# EAGLE design 4 x MIDI Thru Box with LED (EAGLE 6.5.0)
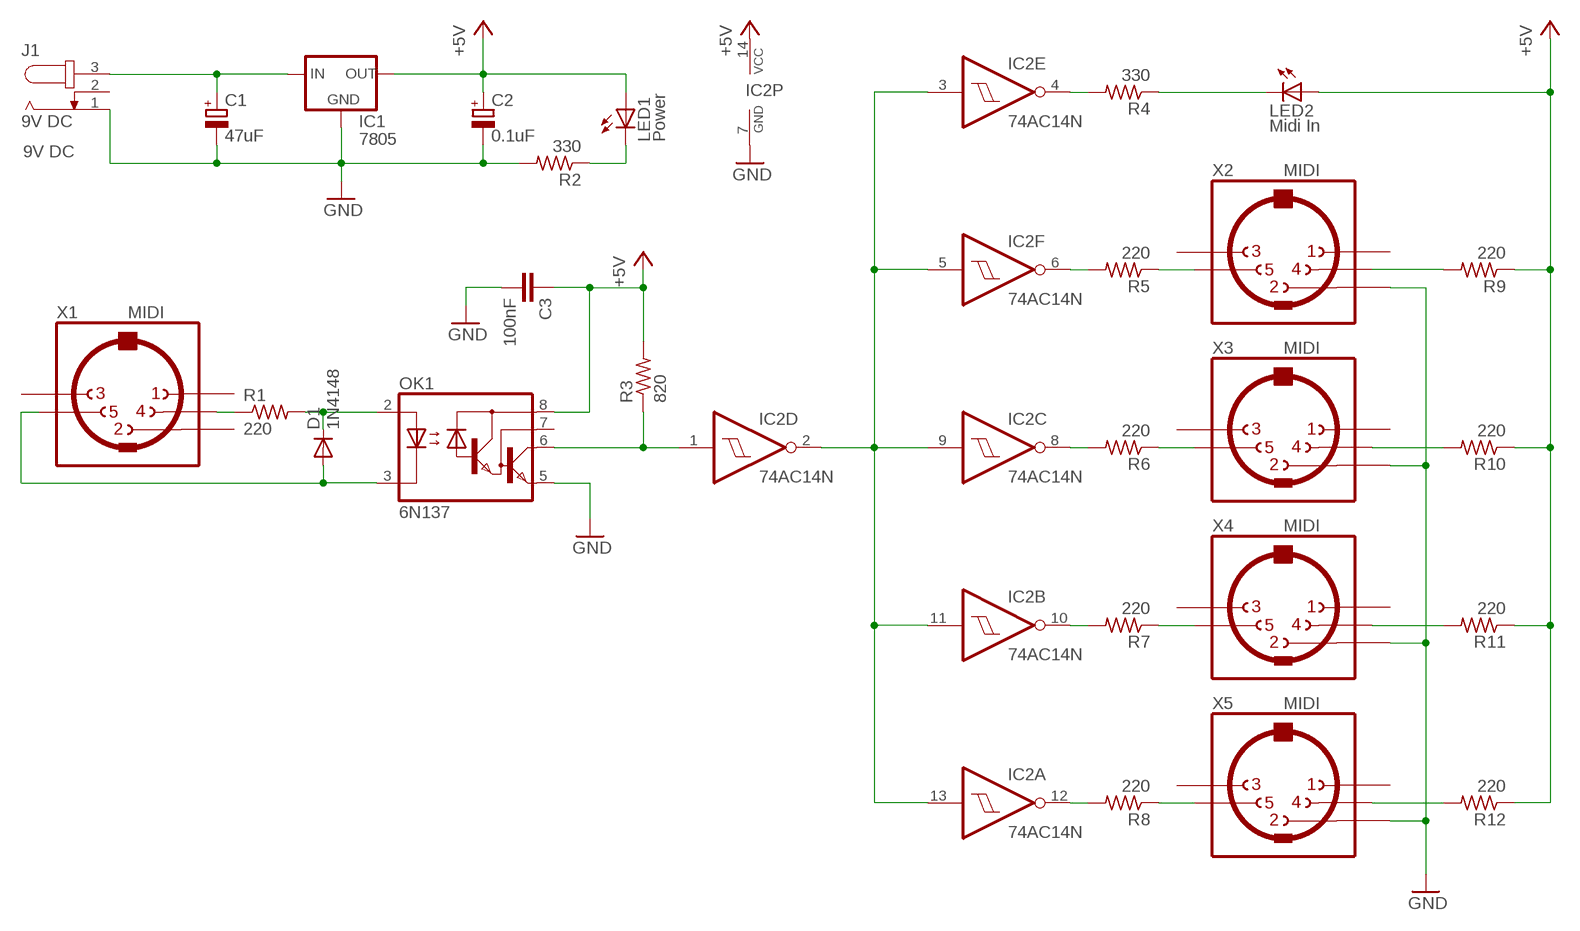
[diagram p0: schematic, sheet 1]

## Parts
C1  47uF  CPOL-EUTT2D6  [TT2D6]
C2  0.1uF  CPOL-EUTT2D6  [TT2D6]
C3  100nF  C-EU025-024X044  [C025-024X044]
D1  1N4148  DIODE-D-5  [D-5]
IC1  7805  78XXS  [78XXS]
IC2  74AC14N  [DIL14]
J1  9V DC  JACK-PLUG2  [SPC4078_BIG_HOLES]
LED1  Power  LED3MM  [LED3MM]
LED2  Midi In  LED3MM  [LED3MM]
OK1  6N137  6N138  [DIL08]
R1  220  R-US_0204/7  [0204/7]
R2  330  R-US_0204/7  [0204/7]
R3  820  R-US_0204/7  [0204/7]
R4  330  R-US_0204/7  [0204/7]
R5  220  R-US_0204/7  [0204/7]
R6  220  R-US_0204/7  [0204/7]
R7  220  R-US_0204/7  [0204/7]
R8  220  R-US_0204/7  [0204/7]
R9  220  R-US_0204/7  [0204/7]
R10  220  R-US_0204/7  [0204/7]
R11  220  R-US_0204/7  [0204/7]
R12  220  R-US_0204/7  [0204/7]
X1  MIDI  MAB5SH  [MAB5SH]
X2  MIDI  MAB5SH  [MAB5SH]
X3  MIDI  MAB5SH  [MAB5SH]
X4  MIDI  MAB5SH  [MAB5SH]
X5  MIDI  MAB5SH  [MAB5SH]

## Nets
+5V: C2.+ C3.1 IC1.OUT IC2.14(P:VCC) LED1.A LED2.A OK1.8(VCC) R3.2 R9.1 R10.1 R11.1 R12.1
GND: C1.- C2.- C3.2 IC1.GND IC2.7(P:GND) J1.1 OK1.5(GND) R2.2 X2.2 X3.2 X4.2 X5.2
MIDI_IN: IC2.1(D:I) OK1.6(VO) R3.1
N$1: IC2.6(F:O) R5.2
N$2: IC2.10(B:O) R7.2
N$3: R8.1 X5.5
N$4: R9.2 X2.4
N$5: LED2.K(C) R4.1
N$6: C1.+ IC1.IN J1.3
N$7: R1.1 X1.4
N$9: LED1.K(C) R2.1
N$11: D1.A OK1.3(C) X1.5
N$14: D1.C OK1.2(A) R1.2
N$17: IC2.2(D:O) IC2.3(E:I) IC2.5(F:I) IC2.9(C:I) IC2.11(B:I) IC2.13(A:I)
N$21: R7.1 X4.5
N$22: IC2.8(C:O) R6.2
N$23: R5.1 X2.5
N$26: IC2.12(A:O) R8.2
N$41: R6.1 X3.5
N$52: R12.2 X5.4
N$53: R11.2 X4.4
N$54: R10.2 X3.4
N$65: IC2.4(E:O) R4.2
Unconnected: J1.2 OK1.7(VB) X1.1 X1.2 X1.3 X2.1 X2.3 X3.1 X3.3 X4.1 X4.3 X5.1 X5.3

## Notes on the sheet
- 9V DC

## Library data of the parts
C1 C2 = rcl:CPOL-EU: POLARIZED CAPACITOR, European symbol
C3 = rcl:C-EU: CAPACITOR, European symbol
D1 = diode:DIODE-: DIODE
IC1 = v-reg:78XXS: VOLTAGE REGULATOR
IC2 = 74xx-eu:74*14: Hex schmitt trigger INVERTER
J1 = con-jack2:JACK-PLUG: DC POWER JACK Power Jack, DC, Right Angle, Through Hole, Rated 5A at 16VDC, PC Terminals Distributor: Farnell (www.Farnell.de) Drawing: 84N1161.pdf / 84N1162.pdf Manufacturer: SPC Technology (www.spctechnology.com) Type: SPC4077 / SPC 4078
LED1 LED2 = led:LED: LED OSRAM: - CHIPLED LG R971, LG N971, LY N971, LG Q971, LY Q971, LO R971, LY R971 LH N974, LH R974 LS Q976, LO Q976, LY Q976 LO Q996 - Hyper CHIPLED LW Q18S LB Q993, LB Q99A, LB R99A - SideLED LS A670, LO A670, LY A670, LG A670, LP A670 LB A673, LV A673, LT A673, LW A673 LH A674 LY A675 LS A676, LA A676, LO A676, LY A676, LW A676 LS A679, LY A679, LG A679 - Hyper Micro SIDELED® LS Y876, LA Y876, LO Y876, LY Y876 LT Y87S - SmartLED LW L88C, LW L88S LB L89C, LB L89S, LG L890 LS L89K, LO L89K, LY L89K LS L896, LA L896, LO L896, LY L896 - TOPLED LS T670, LO T670, LY T670, LG T670, LP T670 LSG T670, LSP T670, LSY T670, LOP T670, LYG T670 LG T671, LOG T671, LSG T671 LB T673, LV T673, LT T673, LW T673 LH T674 LS T676, LA T676, LO T676, LY T676, LB T676, LH T676, LSB T676, LW T676 LB T67C, LV T67C, LT T67C, LS T67K, LO T67K, LY T67K, LW E67C LS E67B, LA E67B, LO E67B, LY E67B, LB E67C, LV E67C, LT E67C LW T67C LS T679, LY T679, LG T679 LS T770, LO T770, LY T770, LG T770, LP T770 LB T773, LV T773, LT T773, LW T773 LH T774 LS E675, LA E675, LY E675, LS T675 LS T776, LA T776, LO T776, LY T776, LB T776 LHGB T686 LT T68C, LB T68C - Hyper Mini TOPLED® LB M676 - Mini TOPLED Santana® LG M470 LS M47K, LO M47K, LY M47K Source: http://www.osram.convergy.de LUXEON: - LUMILED® LXK2-PW12-R00, LXK2-PW12-S00, LXK2-PW14-U00, LXK2-PW14-V00 LXK2-PM12-R00, LXK2-PM12-S00, LXK2-PM14-U00 LXK2-PE12-Q00, LXK2-PE12-R00, LXK2-PE12-S00, LXK2-PE14-T00, LXK2-PE14-U00 LXK2-PB12-K00, LXK2-PB12-L00, LXK2-PB12-M00, LXK2-PB14-N00, LXK2-PB14-P00, LXK2-PB14-Q00 LXK2-PR12-L00, LXK2-PR12-M00, LXK2-PR14-Q00, LXK2-PR14-R00 LXK2-PD12-Q00, LXK2-PD12-R00, LXK2-PD12-S00 LXK2-PH12-R00, LXK2-PH12-S00 LXK2-PL12-P00, LXK2-PL12-Q00, LXK2-PL12-R00 Source: www.luxeon.com KINGBRIGHT: KA-3528ASYC Source: www.kingbright.com
OK1 = optocoupler:6N138: MOTOROLA OPTO COUPLER
R1-R12 = rcl:R-US_: RESISTOR, American symbol
X1-X5 = og-midi:MAB5SH: Female CONNECTOR 5 pins 90 deg. with shield, horizontal (DIN 41524)

## Board
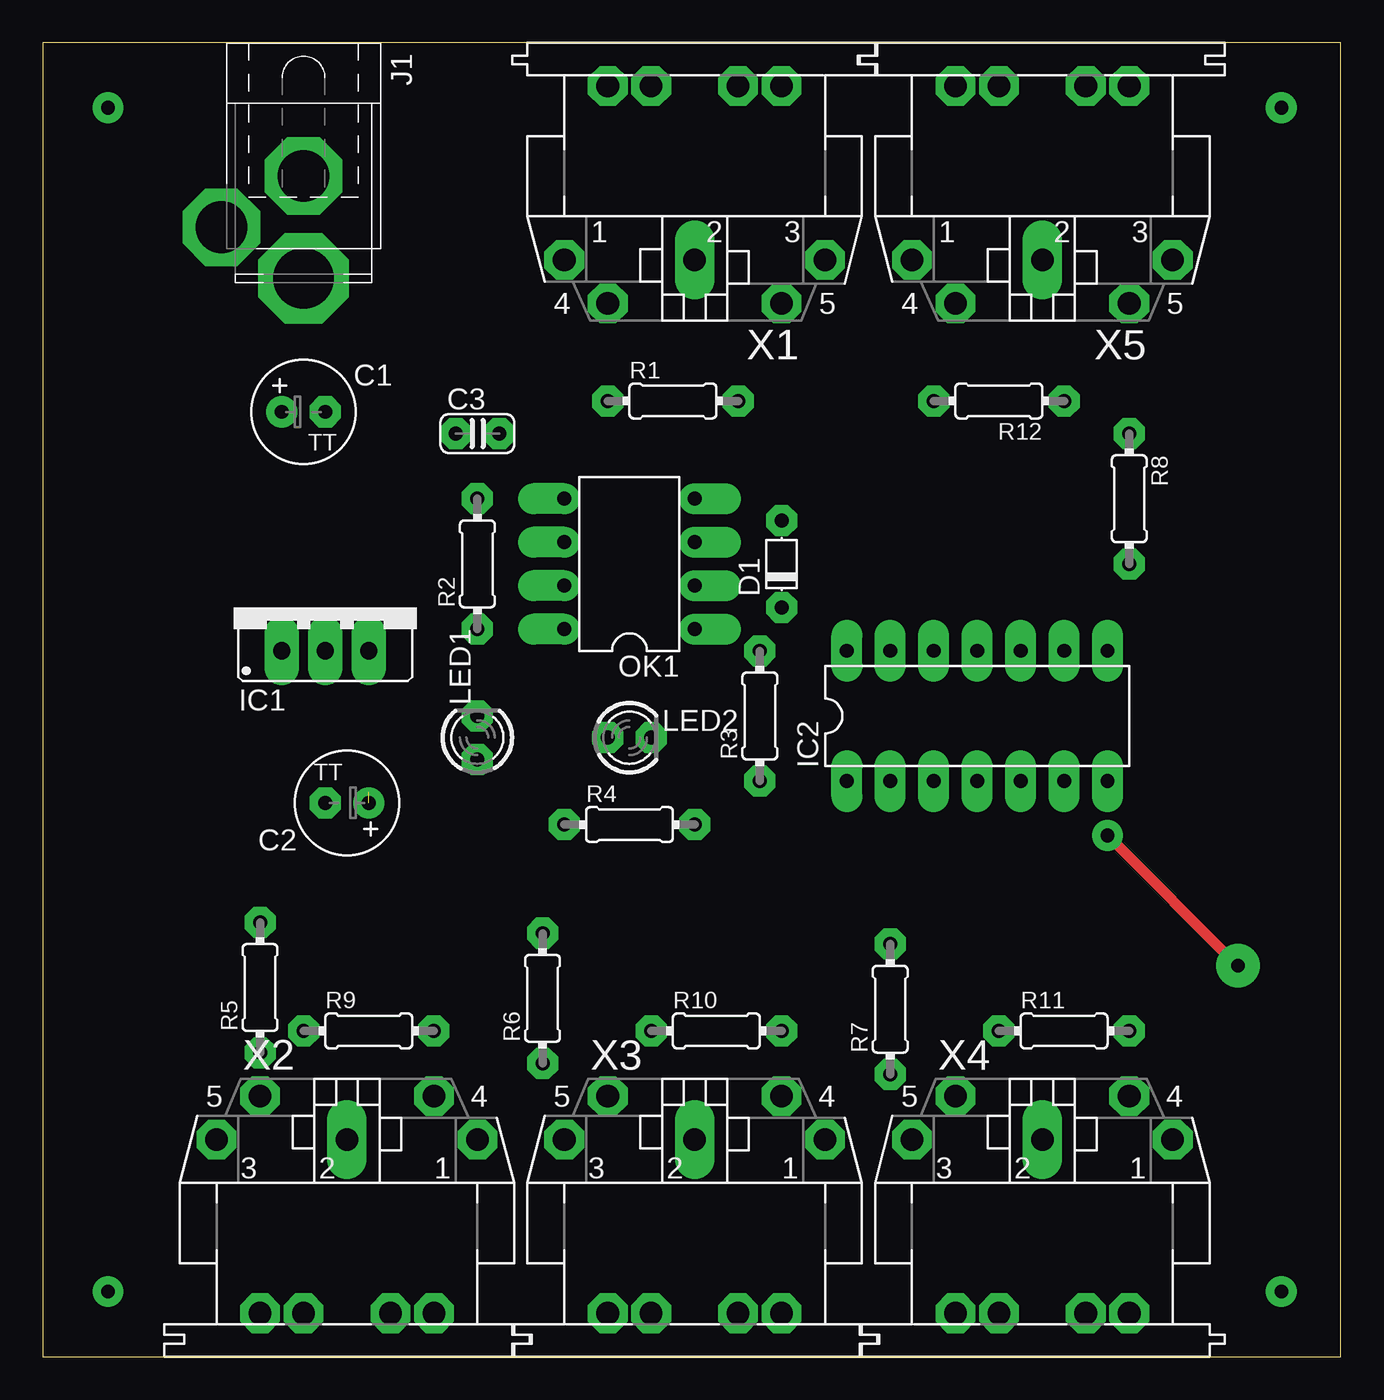
[diagram p1: board, top side]
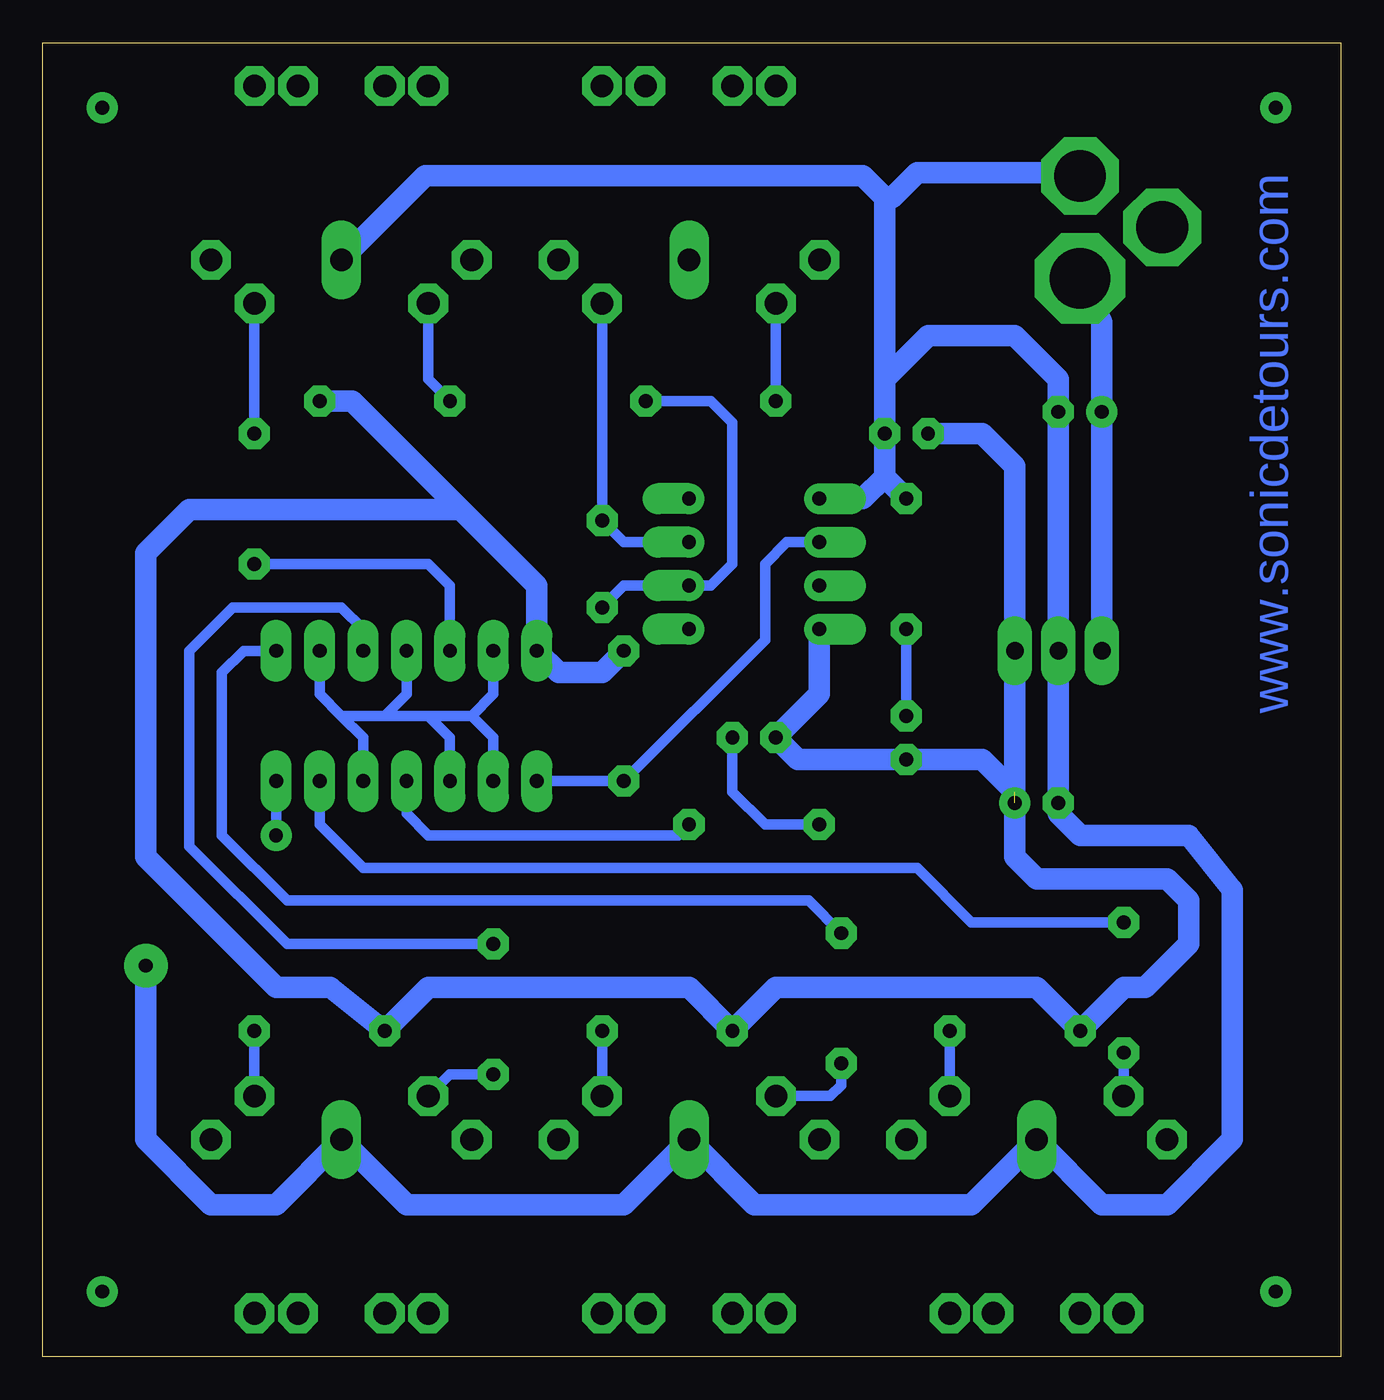
[diagram p2: board, bottom side, seen from below]

Size 75.87 x 76.83 mm. Coordinates in mm from the lower left corner, seen from the top.
Outline: 0,0 75.87,0 75.87,76.83 0,76.83 0,0
Copper layers (1*16): Top 0.035mm / dielectric 1.5mm / Bottom 0.035mm
Design rules "DIY PCB *": minimum track width 24mil, minimum drill 0.8mm, track to track 0.8mm, track to pad 0.8mm, pad to pad 0.25mm, via to via 0.8mm, smd to smd 8mil, copper to edge 40mil, drill to drill 8mil, minimum pad ring 0.5mm, minimum via ring 0.5mm, stop-mask expansion 4mil, vias tented up to drill 0mil, thermal gap 10mil

### Footprints (pad centres in the part's own frame; a part is rotated, then mirrored left to right if it is on the bottom)
TT2D6 = drill 0.813: + -1.27,0 | drill 0.813 octagon: - 1.27,0
C025-024X044 = drill 0.813 octagon: 1 -1.27,0; 2 1.27,0
D-5 = drill 0.813 octagon: A 2.54,0; C -2.54,0
78XXS = drill 1.016 long: GND 0,-2.54; IN -2.54,-2.54; OUT 2.54,-2.54
DIL14 = drill 0.813 long: 1 -7.62,-3.81; 2 -5.08,-3.81; 3 -2.54,-3.81; 4 0,-3.81; 5 2.54,-3.81; 6 5.08,-3.81; 7 7.62,-3.81; 8 7.62,3.81; 9 5.08,3.81; 10 2.54,3.81; 11 0,3.81; 12 -2.54,3.81; 13 -5.08,3.81; 14 -7.62,3.81
SPC4078_BIG_HOLES = drill 3.023 pad 4.318 octagon: 1 -0.46,0; 2 2.54,-4.8 | drill 3.531 pad 4.572 octagon: 3 5.54,0
LED3MM = drill 0.813 octagon: A -1.27,0; K 1.27,0
DIL08 = drill 0.813 offset: 1 -3.81,-3.81; 2 -1.27,-3.81; 3 1.27,-3.81; 4 3.81,-3.81; 5 3.81,3.81; 6 1.27,3.81; 7 -1.27,3.81; 8 -3.81,3.81
0204/7 = drill 0.813 octagon: 1 -3.81,0; 2 3.81,0
MAB5SH = drill 1.321 octagon: 1 7.62,7.62; 3 -7.62,7.62; 4 5.08,10.16; 5 -5.08,10.16; P$1 -5.08,-2.54; P$2 -2.54,-2.54; P$3 2.54,-2.54; P$4 5.08,-2.54 | drill 1.321 long: 2 0,7.62

### Placement (x,y rotation side)
C1  15.24,55.24 0 top
C2  17.78,32.38 180 top
C3  25.4,53.98 0 top
D1  43.18,46.35 90 top
IC1  16.51,43.81 0 top
IC2  54.61,37.47 0 top
J1  15.24,68.58 270 top
LED1  25.4,36.2 90 top
LED2  34.29,36.2 0 top
OK1  34.29,46.35 90 top
R1  36.83,55.88 0 top
R2  25.4,46.35 90 top
R3  41.91,37.47 90 top
R4  34.29,31.11 0 top
R5  12.7,21.59 90 top
R6  29.21,20.95 90 top
R7  49.53,20.32 90 top
R8  63.5,50.16 270 top
R9  19.05,19.05 0 top
R10  39.37,19.05 0 top
R11  59.69,19.05 0 top
R12  55.88,55.88 180 top
X1  38.1,71.75 180 top
X2  17.78,5.08 0 top
X3  38.1,5.08 0 top
X4  58.42,5.08 0 top
X5  58.42,71.75 180 top

### Tracks (layer width: path | path; a pad name or v marks a point on that pad's centre or on a via)
+5V  (1 unrouted)
  Bottom 1.27: R3.2 43.18,40.01 45.72,40.01 IC2.14 46.99,45.09 51.44,49.53 | 51.44,49.53 67.31,49.53 69.85,46.99 69.85,29.21 62.23,21.59 59.05,21.59 R11.1 53.34,21.59 38.1,21.59 R10.1 33.02,21.59 17.78,21.59 R9.1 12.7,21.59 11.43,21.59 8.89,24.13 8.89,26.67 10.16,27.94 17.78,27.94 19.05,29.21 C2.+ | R12.1 57.78,55.88 51.44,49.53 | OK1.8 30.48,38.73 LED2.A 31.75,34.92 LED1.A 20.95,34.92 19.05,33.02 IC1.OUT 19.05,52.07 20.95,53.98 C3.1
GND  (via drill 0.8 pad 1.68, 0.8 pad 2.54)
  Top 0.61: v62.23,30.48 v69.85,22.86
  Bottom 0.61: IC2.7 v62.23,30.48
  Bottom 1.27: R2.2 26.67,51.44 | OK1.5 27.94,50.16 26.67,51.44 | 26.67,57.15 C3.2 26.67,51.44 | 26.67,57.15 26.67,67.77 | v69.85,22.86 69.85,12.7 66.04,8.89 62.23,8.89 X4.2 54.61,8.89 41.91,8.89 X3.2 34.29,8.89 21.59,8.89 X2.2 13.97,8.89 10.16,8.89 6.35,12.7 6.35,27.3 8.89,30.48 15.24,30.48 16.51,31.75 C2.- IC1.GND C1.- 16.51,57.15 19.05,59.69 24.13,59.69 26.67,57.15 | X5.2 53.52,69.04 27.94,69.04 26.67,67.77 | 26.67,67.77 26.21,67.77 24.77,69.22 15.41,69.22 J1.1
MIDI_IN
  Bottom 0.61: IC2.1 R3.1 33.66,41.91 33.66,46.35 32.38,47.62 OK1.6
N$1
  Bottom 0.61: R5.2 21.59,25.4 24.77,28.57 57.15,28.57 59.69,31.11 IC2.6
N$2
  Bottom 0.61: IC2.10 57.15,42.55 58.42,43.81 64.77,43.81 67.31,41.27 67.31,29.84 61.59,24.13 R7.2
N$3
  Bottom 0.61: R8.1 X5.5
N$4
  Bottom 0.61: X2.4 R9.2
N$5
  Bottom 0.61: LED2.K 35.56,33.02 33.66,31.11 R4.1
N$6
  Bottom 1.27: IC1.IN C1.+ 13.97,60.5 J1.3
N$7
  Bottom 0.61: X1.4 R1.1
N$8  (via drill 0.8 pad 0.41)
  other vias: 3.81,3.81
N$9
  Bottom 0.61: R2.1 LED1.K
N$10  (via drill 0.8 pad 0.41)
  other vias: 72.39,3.81
N$11
  Bottom 0.61: X1.5 D1.A 41.91,47.62 OK1.3 40.64,47.62
N$12  (via drill 0.8)
  other vias: 72.39,73.03
N$13  (via drill 0.8 pad 0.41)
  other vias: 3.81,73.03
N$14
  Bottom 0.61: D1.C 41.91,45.09 OK1.2 36.83,45.09 35.56,46.35 35.56,54.61 36.83,55.88 R1.2
N$17
  Bottom 0.61: IC2.2 49.53,36.2 50.8,37.47 | IC2.13 49.53,38.73 50.8,37.47 | IC2.11 54.61,38.73 55.88,37.47 | 55.88,37.47 53.34,37.47 | 53.34,37.47 50.8,37.47 | IC2.3 52.07,36.2 53.34,37.47 | IC2.5 57.15,36.2 58.42,37.47 | 58.42,37.47 55.88,37.47 | IC2.9 59.69,38.73 58.42,37.47
N$21
  Bottom 0.61: R7.1 52.07,16.51 X4.5
N$22
  Bottom 0.61: R6.2 31.11,26.67 61.59,26.67 65.41,30.48 65.41,40.01 64.14,41.27 IC2.8
N$23
  Bottom 0.61: X2.5 R5.1
N$26
  Bottom 0.61: IC2.12 52.07,45.09 53.34,46.35 R8.2
N$41
  Bottom 0.61: R6.1 29.21,15.88 29.84,15.24 X3.5
N$52
  Bottom 0.61: X5.4 53.34,57.15 R12.2
N$53
  Bottom 0.61: X4.4 R11.2
N$54
  Bottom 0.61: X3.4 R10.2
N$65
  Bottom 0.61: IC2.4 54.61,31.75 53.34,30.48 38.73,30.48 R4.2

### Text on the board
Bottom: www.sonicdetours.com